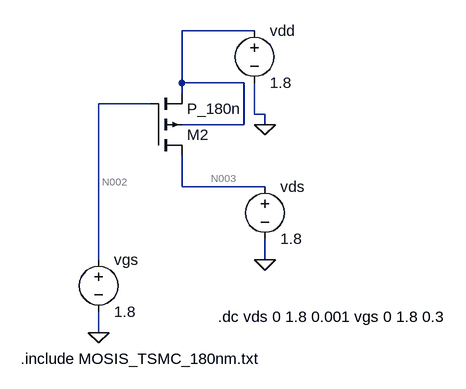
[diagram p0: schematic pmosiv.asc]
pmosiv.asc, the LTspice schematic file:
Version 4
SHEET 1 880 680
WIRE 288 -112 176 -112
WIRE 176 -32 176 -112
WIRE 272 -32 176 -32
WIRE 176 -16 176 -32
WIRE 128 0 48 0
WIRE 288 16 288 -32
WIRE 304 16 288 16
WIRE 272 32 272 -32
WIRE 272 32 176 32
WIRE 304 32 304 16
WIRE 176 128 176 80
WIRE 304 128 176 128
WIRE 48 240 48 0
WIRE 304 240 304 208
WIRE 48 352 48 320
FLAG 48 352 0
FLAG 304 240 0
FLAG 304 32 0
SYMBOL voltage 304 112 R0
SYMATTR InstName vds
SYMATTR Value 1.8
SYMBOL voltage 48 224 R0
SYMATTR InstName vgs
SYMATTR Value 1.8
SYMBOL pmos4 128 80 M180
SYMATTR InstName M2
SYMATTR Value P_180n
SYMATTR Value2 l=180e-9 w=360e-9
SYMBOL voltage 288 -128 R0
SYMATTR InstName vdd
SYMATTR Value 1.8
TEXT -72 392 Left 2 !.include MOSIS_TSMC_180nm.txt
TEXT 232 328 Left 2 !.dc vds 0 1.8 0.001 vgs 0 1.8 0.3

The netlist it stands for:
* pmosiv.asc
vds N003 0 1.8
vgs N002 0 1.8
M2 N003 N002 N001 N001 P_180n l=180e-9 w=360e-9
vdd N001 0 1.8
.model NMOS NMOS
.model PMOS PMOS
.lib standard.mos
.include MOSIS_TSMC_180nm.txt
.dc vds 0 1.8 0.001 vgs 0 1.8 0.3
.backanno
.end

* Results of the author's LTspice run, read from the files saved beside the schematic
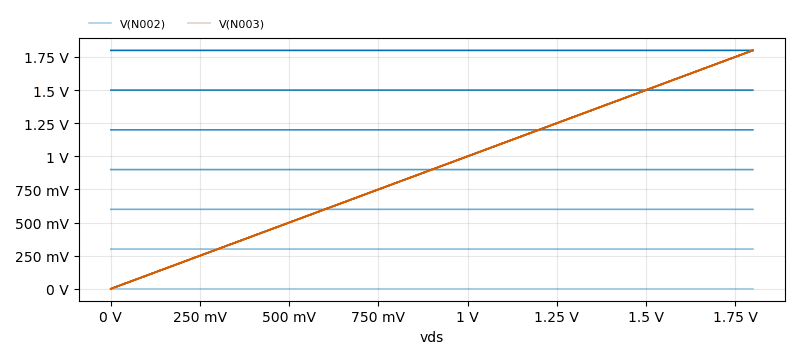
[diagram p1: DC transfer characteristic of pmosiv.asc, plotted from the saved traces]
* DC transfer characteristic, 7 runs:
*   V(N002) [run 1]: 0 V at vds=0 V, 0 V at vds=1.8 V, min 0 V, max 0 V
*   V(N002) [run 2]: 300 mV at vds=0 V, 300 mV at vds=1.8 V, min 300 mV, max 300 mV
*   V(N002) [run 3]: 600 mV at vds=0 V, 600 mV at vds=1.8 V, min 600 mV, max 600 mV
*   V(N002) [run 4]: 900 mV at vds=0 V, 900 mV at vds=1.8 V, min 900 mV, max 900 mV
*   V(N002) [run 5]: 1.2 V at vds=0 V, 1.2 V at vds=1.8 V, min 1.2 V, max 1.2 V
*   V(N002) [run 6]: 1.5 V at vds=0 V, 1.5 V at vds=1.8 V, min 1.5 V, max 1.5 V
*   V(N002) [run 7]: 1.8 V at vds=0 V, 1.8 V at vds=1.8 V, min 1.8 V, max 1.8 V
*   V(N003) [run 1]: 0 V at vds=0 V, 1.8 V at vds=1.8 V, min 0 V, max 1.8 V
*   V(N003) [run 2]: 0 V at vds=0 V, 1.8 V at vds=1.8 V, min 0 V, max 1.8 V
*   V(N003) [run 3]: 0 V at vds=0 V, 1.8 V at vds=1.8 V, min 0 V, max 1.8 V
*   V(N003) [run 4]: 0 V at vds=0 V, 1.8 V at vds=1.8 V, min 0 V, max 1.8 V
*   V(N003) [run 5]: 0 V at vds=0 V, 1.8 V at vds=1.8 V, min 0 V, max 1.8 V
*   V(N003) [run 6]: 0 V at vds=0 V, 1.8 V at vds=1.8 V, min 0 V, max 1.8 V
*   V(N003) [run 7]: 0 V at vds=0 V, 1.8 V at vds=1.8 V, min 0 V, max 1.8 V